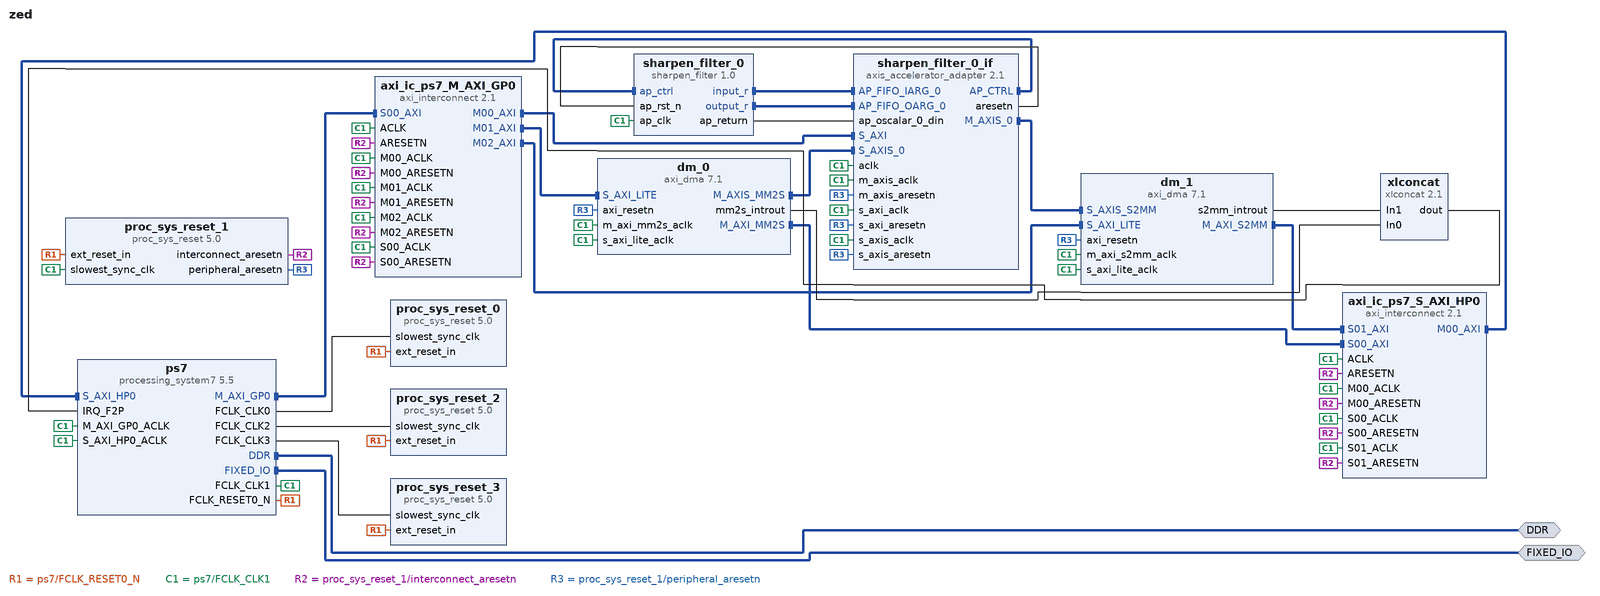
[diagram p0: block diagram of the top level]
# Vivado block design zed, Vivado 2015.4
create_bd_design zed

create_bd_intf_port -mode Master -vlnv xilinx.com:interface:ddrx_rtl:1.0 DDR
create_bd_intf_port -mode Master -vlnv xilinx.com:display_processing_system7:fixedio_rtl:1.0 FIXED_IO

create_bd_cell -type ip -vlnv xilinx.com:ip:proc_sys_reset:5.0 proc_sys_reset_0
set_property -dict {CONFIG.C_AUX_RESET_HIGH 0} [get_bd_cells proc_sys_reset_0]
create_bd_cell -type ip -vlnv xilinx.com:ip:proc_sys_reset:5.0 proc_sys_reset_1
set_property -dict {CONFIG.C_AUX_RESET_HIGH 0} [get_bd_cells proc_sys_reset_1]
create_bd_cell -type ip -vlnv xilinx.com:ip:proc_sys_reset:5.0 proc_sys_reset_2
set_property -dict {CONFIG.C_AUX_RESET_HIGH 0} [get_bd_cells proc_sys_reset_2]
create_bd_cell -type ip -vlnv xilinx.com:ip:proc_sys_reset:5.0 proc_sys_reset_3
set_property -dict {CONFIG.C_AUX_RESET_HIGH 0} [get_bd_cells proc_sys_reset_3]
create_bd_cell -type ip -vlnv xilinx.com:ip:processing_system7:5.5 ps7
set_property -dict [list \
  CONFIG.PCW_FCLK_CLK0_BUF true \
  CONFIG.PCW_FCLK_CLK1_BUF true \
  CONFIG.PCW_FCLK_CLK2_BUF true \
  CONFIG.PCW_FCLK_CLK3_BUF true \
  CONFIG.PCW_UIPARAM_DDR_FREQ_MHZ 533.333313 \
  CONFIG.PCW_APU_PERIPHERAL_FREQMHZ 666.666667 \
  CONFIG.PCW_SDIO_PERIPHERAL_FREQMHZ 50 \
  CONFIG.PCW_UART_PERIPHERAL_FREQMHZ 50 \
  CONFIG.PCW_FPGA0_PERIPHERAL_FREQMHZ 166 \
  CONFIG.PCW_FPGA1_PERIPHERAL_FREQMHZ 142 \
  CONFIG.PCW_FPGA2_PERIPHERAL_FREQMHZ 100 \
  CONFIG.PCW_FPGA3_PERIPHERAL_FREQMHZ 200 \
  CONFIG.PCW_USE_S_AXI_HP0 1 \
  CONFIG.PCW_USE_FABRIC_INTERRUPT 1 \
  CONFIG.PCW_EN_CLK1_PORT 1 \
  CONFIG.PCW_EN_CLK2_PORT 1 \
  CONFIG.PCW_EN_CLK3_PORT 1 \
  CONFIG.PCW_IRQ_F2P_INTR 1 \
  CONFIG.PCW_IMPORT_BOARD_PRESET ZedBoard \
  CONFIG.PCW_PERIPHERAL_BOARD_PRESET part0 \
  CONFIG.PCW_PRESET_BANK1_VOLTAGE {LVCMOS 1.8V} \
  CONFIG.PCW_UIPARAM_DDR_PARTNO {MT41J128M16 HA-15E} \
  CONFIG.PCW_QSPI_PERIPHERAL_ENABLE 0 \
  CONFIG.PCW_ENET0_PERIPHERAL_ENABLE 1 \
  CONFIG.PCW_ENET0_ENET0_IO {MIO 16 .. 27} \
  CONFIG.PCW_ENET0_GRP_MDIO_ENABLE 1 \
  CONFIG.PCW_ENET0_GRP_MDIO_IO {MIO 52 .. 53} \
  CONFIG.PCW_ENET0_RESET_ENABLE 0 \
  CONFIG.PCW_SD0_PERIPHERAL_ENABLE 1 \
  CONFIG.PCW_SD0_SD0_IO {MIO 40 .. 45} \
  CONFIG.PCW_SD0_GRP_CD_ENABLE 1 \
  CONFIG.PCW_SD0_GRP_CD_IO {MIO 47} \
  CONFIG.PCW_SD0_GRP_WP_ENABLE 1 \
  CONFIG.PCW_SD0_GRP_WP_IO {MIO 46} \
  CONFIG.PCW_UART1_PERIPHERAL_ENABLE 1 \
  CONFIG.PCW_UART1_UART1_IO {MIO 48 .. 49} \
  CONFIG.PCW_USB0_PERIPHERAL_ENABLE 1 \
  CONFIG.PCW_USB0_USB0_IO {MIO 28 .. 39} \
  CONFIG.PCW_USB0_RESET_ENABLE 0 \
  CONFIG.PCW_GPIO_MIO_GPIO_ENABLE 1 \
  CONFIG.PCW_GPIO_MIO_GPIO_IO MIO \
  CONFIG.PCW_QSPI_PERIPHERAL_CLKSRC {ARM PLL} \
  CONFIG.PCW_TPIU_PERIPHERAL_CLKSRC {IO PLL} \
  CONFIG.PCW_DCI_PERIPHERAL_CLKSRC 1 \
  CONFIG.PCW_PCAP_PERIPHERAL_CLKSRC 1 \
  CONFIG.PCW_FPGA_FCLK1_ENABLE 1 \
  CONFIG.PCW_FPGA_FCLK2_ENABLE 1 \
  CONFIG.PCW_FPGA_FCLK3_ENABLE 1 \
] [get_bd_cells ps7]
# 352 more settings of ps7 are not shown: defaults, MIO pin electricals, DDR timing, and values the tool derives
create_bd_cell -type ip -vlnv xilinx.com:ip:xlconcat:2.1 xlconcat
set_property -dict {CONFIG.NUM_PORTS 2} [get_bd_cells xlconcat]
create_bd_cell -type ip -vlnv xilinx.com:ip:axi_dma:7.1 dm_0
set_property -dict [list \
  CONFIG.c_include_sg 0 \
  CONFIG.c_sg_length_width 23 \
  CONFIG.c_dlytmr_resolution 1250 \
  CONFIG.c_include_mm2s 1 \
  CONFIG.c_m_axi_mm2s_data_width 64 \
  CONFIG.c_m_axis_mm2s_tdata_width 64 \
  CONFIG.c_include_mm2s_dre 1 \
  CONFIG.c_include_mm2s_sf 1 \
  CONFIG.c_mm2s_burst_size 64 \
  CONFIG.c_include_s2mm 0 \
] [get_bd_cells dm_0]
create_bd_cell -type ip -vlnv xilinx.com:ip:axi_dma:7.1 dm_1
set_property -dict [list \
  CONFIG.c_include_sg 0 \
  CONFIG.c_sg_length_width 23 \
  CONFIG.c_dlytmr_resolution 1250 \
  CONFIG.c_include_mm2s 0 \
  CONFIG.c_include_s2mm 1 \
  CONFIG.c_m_axi_s2mm_data_width 64 \
  CONFIG.c_s_axis_s2mm_tdata_width 64 \
  CONFIG.c_include_s2mm_dre 1 \
  CONFIG.c_include_s2mm_sf 1 \
  CONFIG.c_s2mm_burst_size 64 \
] [get_bd_cells dm_1]
create_bd_cell -type ip -vlnv xilinx.com:hls:sharpen_filter:1.0 sharpen_filter_0
create_bd_cell -type ip -vlnv xilinx.com:ip:axis_accelerator_adapter:2.1 sharpen_filter_0_if
set_property -dict [list \
  CONFIG.C_AP_OARG_0_DWIDTH 8 \
  CONFIG.C_M_AXIS_TDATA_WIDTH 64 \
  CONFIG.C_AP_IARG_0_DWIDTH 8 \
  CONFIG.C_S_AXIS_TDATA_WIDTH 64 \
  CONFIG.C_N_OUTPUT_ARGS 1 \
  CONFIG.C_N_INPUT_ARGS 1 \
  CONFIG.C_AP_IARG_0_WIDTH 8 \
  CONFIG.C_AP_IARG_0_TYPE 1 \
  CONFIG.C_AP_IARG_0_DIM_1 1024 \
  CONFIG.C_AP_OARG_0_WIDTH 8 \
  CONFIG.C_AP_OARG_0_TYPE 1 \
  CONFIG.C_AP_OARG_0_DIM_1 1024 \
  CONFIG.C_N_OUTPUT_SCALARS 1 \
  CONFIG.C_OUTPUT_SCALAR_0_WIDTH 32 \
  CONFIG.C_M_AXIS_HAS_TSTRB 1 \
  CONFIG.C_M_AXIS_HAS_TKEEP 1 \
] [get_bd_cells sharpen_filter_0_if]
create_bd_cell -type ip -vlnv xilinx.com:ip:axi_interconnect:2.1 axi_ic_ps7_M_AXI_GP0
set_property -dict [list \
  CONFIG.NUM_SI 1 \
  CONFIG.NUM_MI 3 \
  CONFIG.STRATEGY 2 \
  CONFIG.M00_HAS_REGSLICE 1 \
  CONFIG.M01_HAS_REGSLICE 1 \
  CONFIG.M02_HAS_REGSLICE 1 \
  CONFIG.S00_HAS_REGSLICE 1 \
] [get_bd_cells axi_ic_ps7_M_AXI_GP0]
create_bd_cell -type ip -vlnv xilinx.com:ip:axi_interconnect:2.1 axi_ic_ps7_S_AXI_HP0
set_property -dict [list \
  CONFIG.NUM_SI 2 \
  CONFIG.NUM_MI 1 \
  CONFIG.STRATEGY 2 \
  CONFIG.M00_HAS_REGSLICE 1 \
  CONFIG.M00_HAS_DATA_FIFO 2 \
  CONFIG.S00_HAS_REGSLICE 1 \
  CONFIG.S01_HAS_REGSLICE 1 \
  CONFIG.S00_HAS_DATA_FIFO 2 \
  CONFIG.S01_HAS_DATA_FIFO 2 \
] [get_bd_cells axi_ic_ps7_S_AXI_HP0]

# ---- connections ----

connect_bd_intf_net [get_bd_intf_pins sharpen_filter_0_if/AP_CTRL] [get_bd_intf_pins sharpen_filter_0/ap_ctrl]
connect_bd_intf_net [get_bd_intf_pins sharpen_filter_0/input_r] [get_bd_intf_pins sharpen_filter_0_if/AP_FIFO_IARG_0]
connect_bd_intf_net [get_bd_intf_pins sharpen_filter_0/output_r] [get_bd_intf_pins sharpen_filter_0_if/AP_FIFO_OARG_0]
connect_bd_intf_net [get_bd_intf_pins ps7/M_AXI_GP0] [get_bd_intf_pins axi_ic_ps7_M_AXI_GP0/S00_AXI]
connect_bd_intf_net [get_bd_intf_pins axi_ic_ps7_S_AXI_HP0/M00_AXI] [get_bd_intf_pins ps7/S_AXI_HP0]
connect_bd_intf_net [get_bd_intf_pins axi_ic_ps7_M_AXI_GP0/M00_AXI] [get_bd_intf_pins sharpen_filter_0_if/S_AXI]
connect_bd_intf_net [get_bd_intf_pins axi_ic_ps7_M_AXI_GP0/M01_AXI] [get_bd_intf_pins dm_0/S_AXI_LITE]
connect_bd_intf_net [get_bd_intf_pins dm_0/M_AXI_MM2S] [get_bd_intf_pins axi_ic_ps7_S_AXI_HP0/S00_AXI]
connect_bd_intf_net [get_bd_intf_pins dm_0/M_AXIS_MM2S] [get_bd_intf_pins sharpen_filter_0_if/S_AXIS_0]
connect_bd_intf_net [get_bd_intf_pins axi_ic_ps7_M_AXI_GP0/M02_AXI] [get_bd_intf_pins dm_1/S_AXI_LITE]
connect_bd_intf_net [get_bd_intf_pins dm_1/M_AXI_S2MM] [get_bd_intf_pins axi_ic_ps7_S_AXI_HP0/S01_AXI]
connect_bd_intf_net [get_bd_intf_pins sharpen_filter_0_if/M_AXIS_0] [get_bd_intf_pins dm_1/S_AXIS_S2MM]
connect_bd_intf_net [get_bd_intf_ports DDR] [get_bd_intf_pins ps7/DDR]
connect_bd_intf_net [get_bd_intf_ports FIXED_IO] [get_bd_intf_pins ps7/FIXED_IO]
connect_bd_net -net xlconcat_1_dout [get_bd_pins xlconcat/dout] [get_bd_pins ps7/IRQ_F2P]
connect_bd_net -net clkid0 [get_bd_pins ps7/FCLK_CLK0] [get_bd_pins proc_sys_reset_0/slowest_sync_clk]
connect_bd_net [get_bd_pins ps7/FCLK_RESET0_N] \
  [get_bd_pins proc_sys_reset_0/ext_reset_in] [get_bd_pins proc_sys_reset_1/ext_reset_in] \
  [get_bd_pins proc_sys_reset_2/ext_reset_in] [get_bd_pins proc_sys_reset_3/ext_reset_in]
connect_bd_net -net clkid1 [get_bd_pins ps7/FCLK_CLK1] \
  [get_bd_pins proc_sys_reset_1/slowest_sync_clk] [get_bd_pins dm_0/s_axi_lite_aclk] [get_bd_pins dm_0/m_axi_mm2s_aclk] \
  [get_bd_pins dm_1/s_axi_lite_aclk] [get_bd_pins dm_1/m_axi_s2mm_aclk] [get_bd_pins ps7/M_AXI_GP0_ACLK] \
  [get_bd_pins ps7/S_AXI_HP0_ACLK] [get_bd_pins sharpen_filter_0/ap_clk] [get_bd_pins sharpen_filter_0_if/s_axi_aclk] \
  [get_bd_pins sharpen_filter_0_if/aclk] [get_bd_pins sharpen_filter_0_if/m_axis_aclk] \
  [get_bd_pins sharpen_filter_0_if/s_axis_aclk] [get_bd_pins axi_ic_ps7_M_AXI_GP0/ACLK] \
  [get_bd_pins axi_ic_ps7_M_AXI_GP0/S00_ACLK] [get_bd_pins axi_ic_ps7_M_AXI_GP0/M00_ACLK] \
  [get_bd_pins axi_ic_ps7_M_AXI_GP0/M01_ACLK] [get_bd_pins axi_ic_ps7_M_AXI_GP0/M02_ACLK] \
  [get_bd_pins axi_ic_ps7_S_AXI_HP0/ACLK] [get_bd_pins axi_ic_ps7_S_AXI_HP0/M00_ACLK] \
  [get_bd_pins axi_ic_ps7_S_AXI_HP0/S00_ACLK] [get_bd_pins axi_ic_ps7_S_AXI_HP0/S01_ACLK]
connect_bd_net -net clkid2 [get_bd_pins ps7/FCLK_CLK2] [get_bd_pins proc_sys_reset_2/slowest_sync_clk]
connect_bd_net -net clkid3 [get_bd_pins ps7/FCLK_CLK3] [get_bd_pins proc_sys_reset_3/slowest_sync_clk]
connect_bd_net [get_bd_pins sharpen_filter_0_if/aresetn] [get_bd_pins sharpen_filter_0/ap_rst_n]
connect_bd_net [get_bd_pins sharpen_filter_0/ap_return] [get_bd_pins sharpen_filter_0_if/ap_oscalar_0_din]
connect_bd_net [get_bd_pins proc_sys_reset_1/interconnect_aresetn] \
  [get_bd_pins axi_ic_ps7_M_AXI_GP0/ARESETN] [get_bd_pins axi_ic_ps7_M_AXI_GP0/S00_ARESETN] \
  [get_bd_pins axi_ic_ps7_M_AXI_GP0/M00_ARESETN] [get_bd_pins axi_ic_ps7_M_AXI_GP0/M01_ARESETN] \
  [get_bd_pins axi_ic_ps7_M_AXI_GP0/M02_ARESETN] [get_bd_pins axi_ic_ps7_S_AXI_HP0/ARESETN] \
  [get_bd_pins axi_ic_ps7_S_AXI_HP0/M00_ARESETN] [get_bd_pins axi_ic_ps7_S_AXI_HP0/S00_ARESETN] \
  [get_bd_pins axi_ic_ps7_S_AXI_HP0/S01_ARESETN]
connect_bd_net [get_bd_pins proc_sys_reset_1/peripheral_aresetn] \
  [get_bd_pins dm_0/axi_resetn] [get_bd_pins dm_1/axi_resetn] [get_bd_pins sharpen_filter_0_if/s_axi_aresetn] \
  [get_bd_pins sharpen_filter_0_if/m_axis_aresetn] [get_bd_pins sharpen_filter_0_if/s_axis_aresetn]
connect_bd_net [get_bd_pins dm_0/mm2s_introut] [get_bd_pins xlconcat/In0]
connect_bd_net [get_bd_pins dm_1/s2mm_introut] [get_bd_pins xlconcat/In1]

# ---- address map ----
assign_bd_address -offset 0x00000000 -range 512M -target_address_space [get_bd_addr_spaces dm_0/Data_MM2S] [get_bd_addr_segs ps7/S_AXI_HP0/HP0_DDR_LOWOCM]
assign_bd_address -offset 0x00000000 -range 512M -target_address_space [get_bd_addr_spaces dm_1/Data_S2MM] [get_bd_addr_segs ps7/S_AXI_HP0/HP0_DDR_LOWOCM]
assign_bd_address -offset 0x40400000 -range 64K -target_address_space [get_bd_addr_spaces ps7/Data] [get_bd_addr_segs dm_0/S_AXI_LITE/Reg]
assign_bd_address -offset 0x40410000 -range 64K -target_address_space [get_bd_addr_spaces ps7/Data] [get_bd_addr_segs dm_1/S_AXI_LITE/Reg]
assign_bd_address -offset 0x43C00000 -range 64K -target_address_space [get_bd_addr_spaces ps7/Data] [get_bd_addr_segs sharpen_filter_0_if/S_AXI/Reg]

validate_bd_design
save_bd_design
